# EAGLE design eDP_DLT (EAGLE 9.4.2)
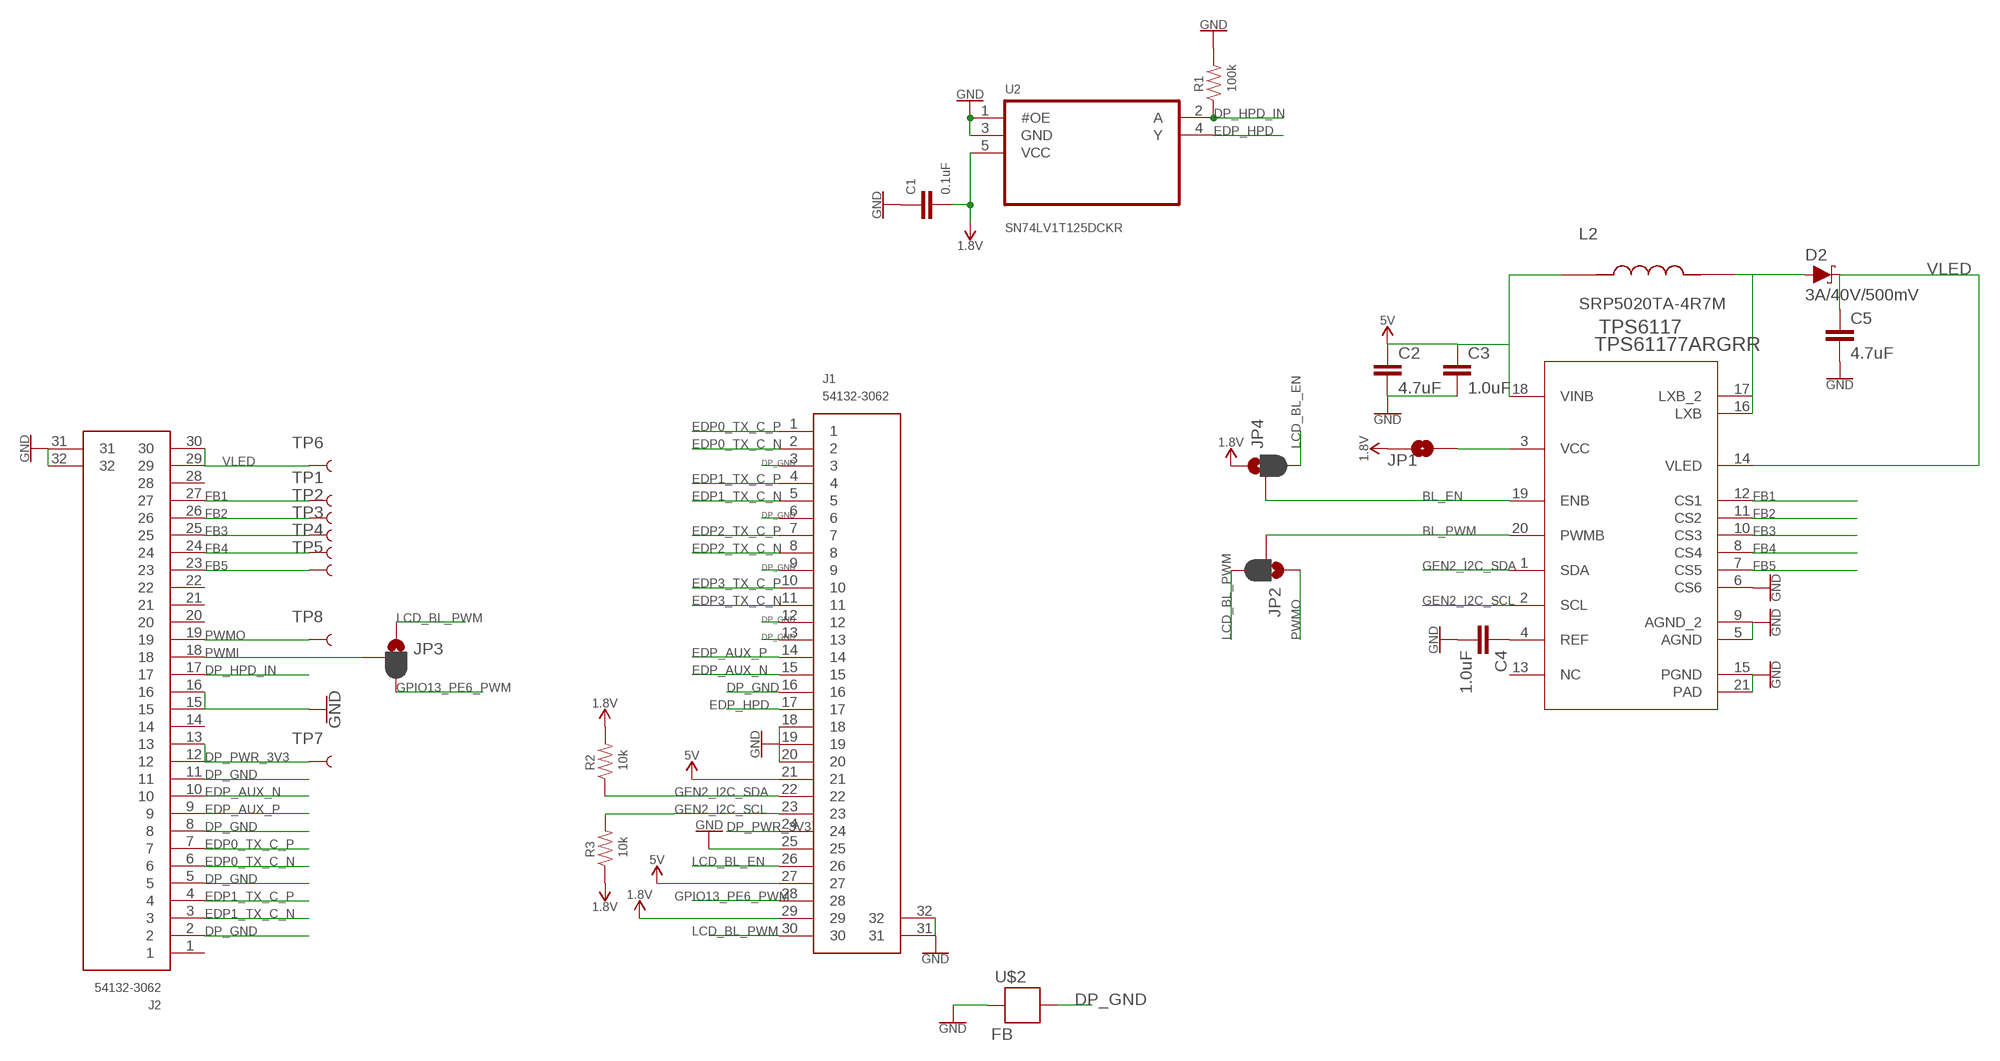
[diagram p0: schematic, sheet 1]

## Parts
C1  0.1uF  10NF-0603-50V-10%  [0603]
C2  4.7uF  4.7UF0603  [0603]
C3  1.0uF  1.0UF-0603-16V-10%  [0603]
C4  1.0uF  1.0UF-0603-16V-10%  [0603]
C5  4.7uF  4.7UF0603  [0603]
D2  3A/40V/500mV  DIODE-SCHOTTKY-B340A  [SMA-DIODE]
J1  54132-3062  [54132-3062]
J2  54132-3062  [54132-3062]
JP1  JUMPER-SMT_2_NO_NO-SILK  [SMT-JUMPER_2_NO_NO-SILK]
JP2  JUMPER-SMT_3_1-NC_PASTE_NO-SILK  [SMT-JUMPER_3_1-NC_PASTE_NO-SILK]
JP3  JUMPER-SMT_3_1-NC_PASTE_NO-SILK  [SMT-JUMPER_3_1-NC_PASTE_NO-SILK]
JP4  JUMPER-SMT_3_1-NC_PASTE_NO-SILK  [SMT-JUMPER_3_1-NC_PASTE_NO-SILK]
L2  SRP5020TA-4R7M  [IND_SRP5020TA-4R7M]
R1  100k  RESISTOR0603-RES  [0603-RES]
R2  10k  RESISTOR0603-RES  [0603-RES]
R3  10k  RESISTOR0603-RES  [0603-RES]
TP1  TEST-POINT3  [PAD.03X.03]
TP2  TEST-POINT3  [PAD.03X.03]
TP3  TEST-POINT3  [PAD.03X.03]
TP4  TEST-POINT3  [PAD.03X.03]
TP5  TEST-POINT3  [PAD.03X.03]
TP6  TEST-POINT3  [PAD.03X.03]
TP7  TEST-POINT3  [PAD.03X.03]
TP8  TEST-POINT3  [PAD.03X.03]
TPS6117  TPS61177ARGRR  [RGR0020A]
U2  SN74LV1T125DCKR  [SOT65P210X110-5N]
U$2  FB  [0603]

## Nets
1.8V: C1.2 J1.29 JP1.1 JP4.1 R2.2 R3.1 U2.5(VCC)
5V: C2.1 C3.1 J1.21 J1.27 L2.1 TPS6117.18(VINB)
BL_EN: JP4.2 TPS6117.19(ENB)
BL_PWM: JP2.2 TPS6117.20(PWMB)
DP_GND: J1.3 J1.6 J1.9 J1.12 J1.13 J1.16 J2.2 J2.5 J2.8 J2.11 U$2.1
DP_HPD_IN: J2.17 R1.1 U2.2(A)
DP_PWR_3V3: J1.24 J2.12 J2.13 TP7.P$1
EDP0_TX_C_N: J1.2 J2.6
EDP0_TX_C_P: J1.1 J2.7
EDP1_TX_C_N: J1.5 J2.3
EDP1_TX_C_P: J1.4 J2.4
EDP2_TX_C_N: J1.8
EDP2_TX_C_P: J1.7
EDP3_TX_C_N: J1.11
EDP3_TX_C_P: J1.10
EDP_AUX_N: J1.15 J2.10
EDP_AUX_P: J1.14 J2.9
EDP_HPD: J1.17 U2.4(Y)
FB1: J2.27 TP1.P$1 TPS6117.12(CS1)
FB2: J2.26 TP2.P$1 TPS6117.11(CS2)
FB3: J2.25 TP3.P$1 TPS6117.10(CS3)
FB4: J2.24 TP4.P$1 TPS6117.8(CS4)
FB5: J2.23 TP5.P$1 TPS6117.7(CS5)
GEN2_I2C_SCL: J1.23 R3.2 TPS6117.2(SCL)
GEN2_I2C_SDA: J1.22 R2.1 TPS6117.1(SDA)
GND: C1.1 C2.2 C3.2 C4.2 C5.2 J1.18 J1.19 J1.20 J1.25 J1.31 J1.32 J2.15 J2.16 J2.31 J2.32 R1.2 TPS6117.5(AGND) TPS6117.6(CS6) TPS6117.9(AGND_2) TPS6117.15(PGND) TPS6117.21(PAD) U2.1(#OE) U2.3(GND) U$2.2
GPIO13_PE6_PWM: J1.28 JP3.3
LCD_BL_EN: J1.26 JP4.3
LCD_BL_PWM: J1.30 JP2.3 JP3.1
LXB: D2.A L2.2 TPS6117.16(LXB) TPS6117.17(LXB_2)
N$1: JP1.2 TPS6117.3(VCC)
N$3: C4.1 TPS6117.4(REF)
PWMI: J2.18 JP3.2
PWMO: J2.19 JP2.1 TP8.P$1
VLED: C5.1 D2.C J2.29 J2.30 TP6.P$1 TPS6117.14(VLED)
Unconnected: J2.1 J2.14 J2.20 J2.21 J2.22 J2.28 TPS6117.13(NC)

## Library data of the parts
C1 = SparkFun-Capacitors:10NF: 0.01uF/10nF/10,000pF ceramic capacitors A capacitor is a passive two-terminal electrical component used to store electrical energy temporarily in an electric field. CAP-09321; PROD_ID: CAP-00867; VALUE: 10nF
C2 C5 = SparkFun-Capacitors:4.7UF: 4.7µF ceramic capacitors A capacitor is a passive two-terminal electrical component used to store electrical energy temporarily in an electric field.; PROD_ID: CAP-08280
C3 C4 = SparkFun-Capacitors:1.0UF: 1µF ceramic capacitors A capacitor is a passive two-terminal electrical component used to store electrical energy temporarily in an electric field.; PROD_ID: CAP-00868
D2 = SparkFun-DiscreteSemi:DIODE-SCHOTTKY: Schottky diode A Schottky diode is a semiconductor diode which has a low forward voltage drop and a very fast switching action.; PROD_ID: DIO-09886
J1 J2 = 54132-3062:54132-3062: Connector 0.5mm, FFC/FPC, SMT,r/a,30w,Au Molex FFC/FPC SMT Series 0.5mm Pitch 30 Way Right Angle SMT Female FPC Connector, ZIF Bottom Contact Source: Datasheet <https://componentsearchengine.com/Datasheets/1/54132-3062.pdf>; DESCRIPTION: Connector 0.5mm, FFC/FPC, SMT,r/a,30w,Au Molex FFC/FPC SMT Series 0.5mm Pitch 30 Way Right Angle SMT Female FPC Connector, ZIF Bottom Contact; HEIGHT: mm; MANUFACTURER_NAME: Molex; MANUFACTURER_PART_NUMBER: 54132-3062; MOUSER_PART_NUMBER: 538-54132-3062; MOUSER_PRICE-STOCK: https://www.mouser.com/Search/Refine.aspx?Keyword=538-54132-3062
JP1 = SparkFun-Jumpers:JUMPER-SMT_2_NO: Normally open jumper This jumper has two pads in close proximity to each other. Apply solder to close the connection. Round pads are easier to solder for beginners, but are a lot larger. SparkFun Product that uses the round pads: SparkFun EL Sequencer <https://www.sparkfun.com/products/12781>
JP2-JP4 = SparkFun-Jumpers:JUMPER-SMT_3_1-NC_PASTE: Normally closed solder jumper (1 of 2 connections) This jumper has an aperture in the stencil to allow solder paste to bridge one of the two connections. One connection is normally closed (NC), while the other is normally open (NO). Wick off the solder to open the connection. Reapply solder to reclose the connection. Apply solder to the other side instead to change the current path.
L2 = Custom-Parts:SRP5020TA-4R7M: Ind Chip Power Shielded Wirewound 4.7uH 20% 100KHz 18Q-Factor Metal 2.8A T/R; AVAILABILITY: Unavailable; DESCRIPTION: Ind Chip Power Shielded Wirewound 4.7uH 20% 100KHz 18Q-Factor Metal 2.8A T/R; MF: Bourns; MP: SRP5020TA-4R7M; PACKAGE: Nonstandard Bourns; PRICE: None
R1-R3 = SparkFun-Passives:RESISTOR: Resistor Basic schematic elements and footprints for 0603, 1206, and PTH resistors.
TP1-TP8 = SparkFun-Connectors:TEST-POINT: SparkFun Test Points Bare copper test points for troubleshooting or In-Circuit-Testing. These are used by our Production team for verifying production board runs using pogo-pins on test beds. SparkFun Products: SparkFun LSM9DS1 Breakout <https://www.sparkfun.com/products/13284> SparkFun PSOC <https://www.sparkfun.com/products/13714> SparkFun Load Cell Amplifier <https://www.sparkfun.com/products/13879>
TPS6117 = Custom-Parts:TPS61177ARGRR
U2 = SN74LV1T125DCKR:SN74LV1T125DCKR: None; AVAILABILITY: Unavailable; DESCRIPTION: Single Power Supply, Single BUFFER GATE w/ 3-State Output _active low enable_ 5-SC70 -40 to 125; MF: Texas Instruments; MP: SN74LV1T125DCKR; PACKAGE: SC-70-5 Texas Instruments; PRICE: None
U$2 = SparkFun-Passives:FB

## Board
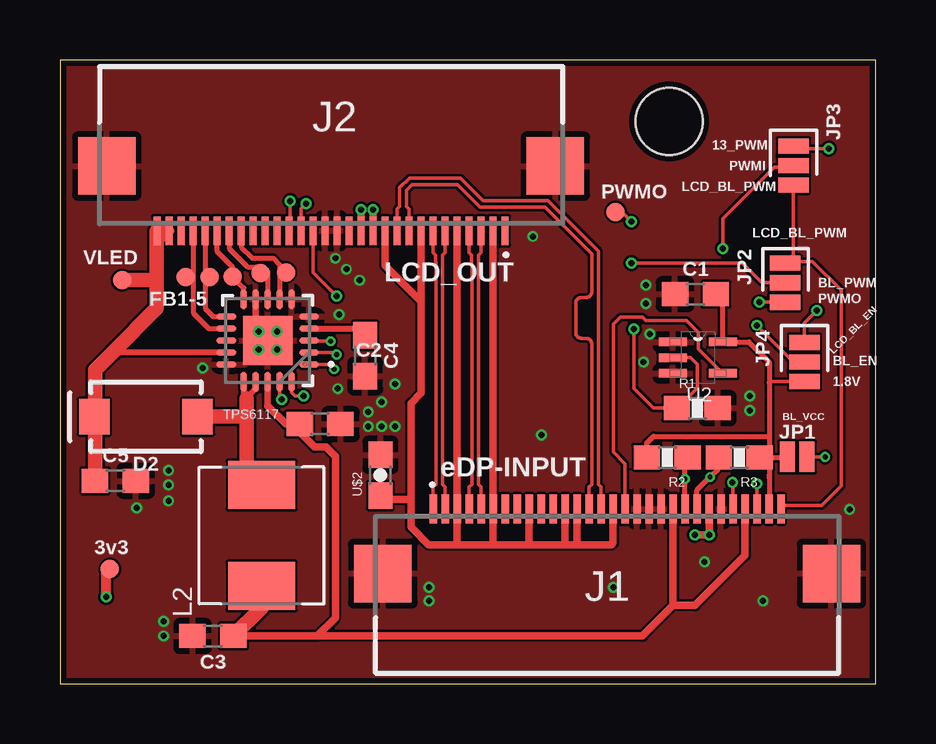
[diagram p1: board, top side]
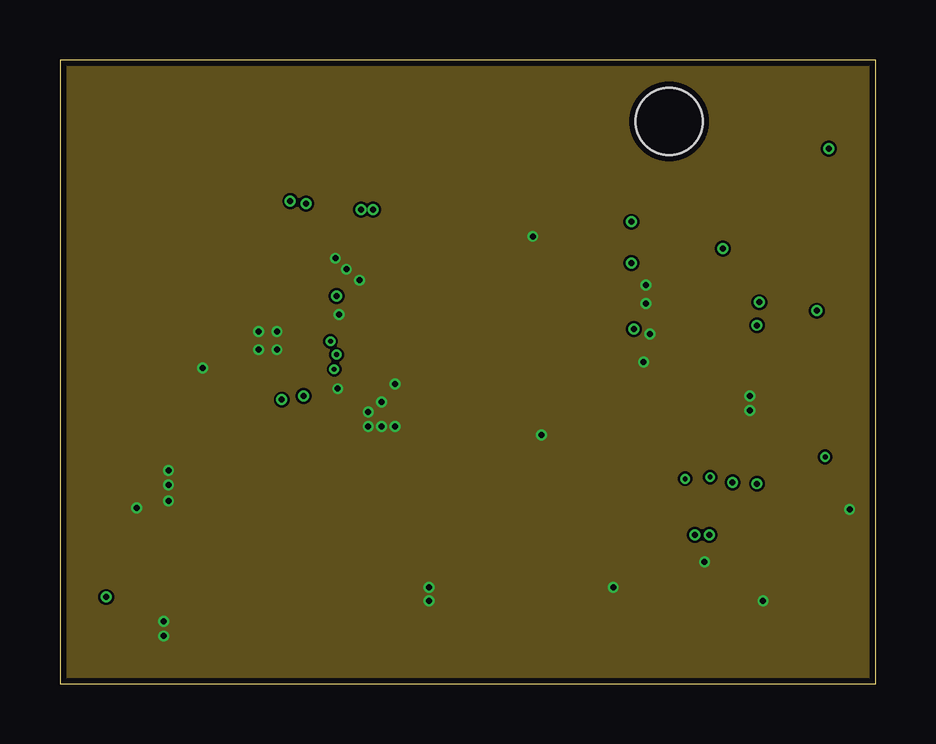
[diagram p2: board, inner layer Route2]
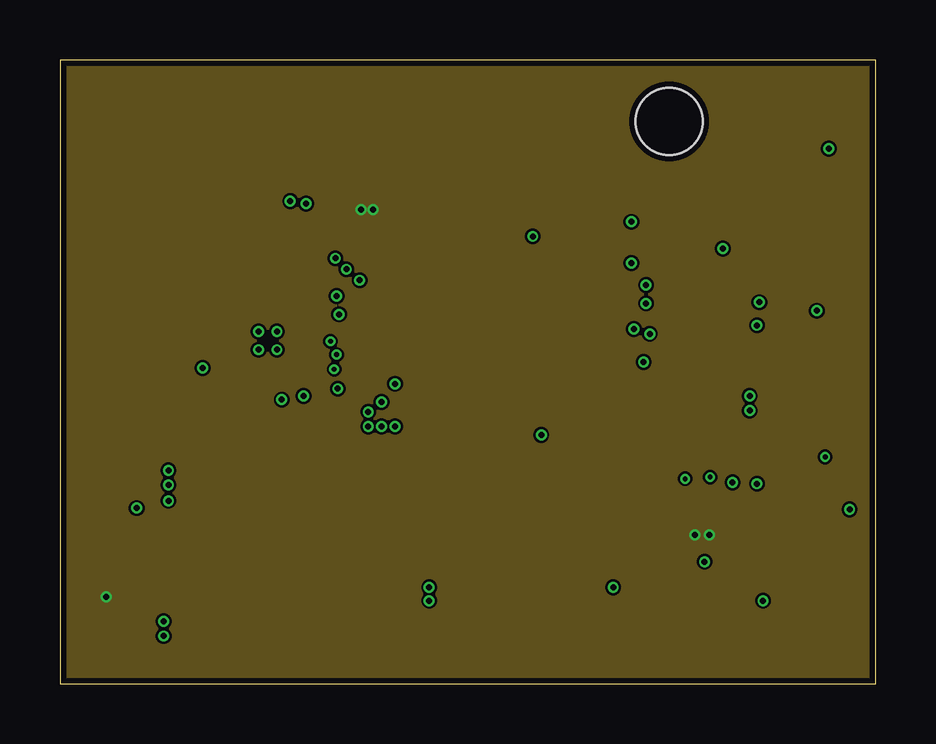
[diagram p3: board, inner layer Route15]
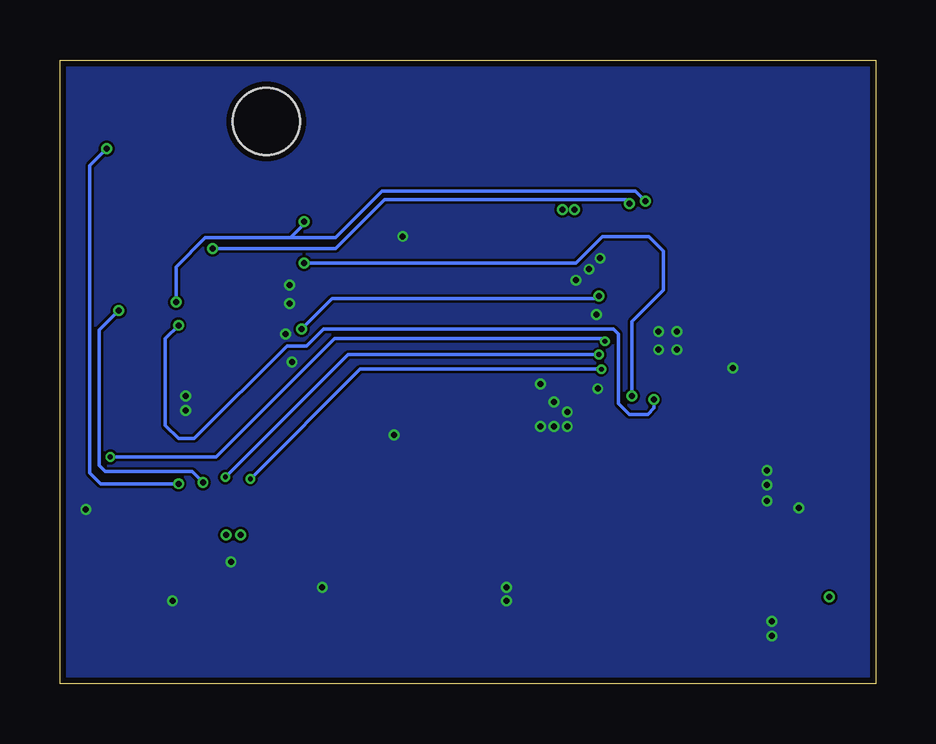
[diagram p4: board, bottom side, seen from below]

Size 34 x 26 mm. Coordinates in mm from the lower left corner, seen from the top.
Outline: 0,0 34,0 34,26 0,26 0,0
Copper layers (1*2*15*16): Top 0.035mm / dielectric 0.2mm / Route2 0.0175mm / dielectric 0.3mm / Route15 0.0175mm / dielectric 0.2mm / Bottom 0.035mm
Design rules "SeeedStudio_4layer_DRU_no_angle_20140221 *": minimum track width 4mil, minimum drill 0.2mm, track to track 4mil, track to pad 4mil, pad to pad 4mil, via to via 4mil, smd to smd 0mil, copper to edge 10mil, drill to drill 8mil, minimum pad ring 6mil, minimum via ring 4mil, stop-mask expansion 4mil, vias tented up to drill 25mil, thermal gap 10mil
Holes 2.8 mm at 25.39,23.44

### Footprints (pad centres in the part's own frame; a part is rotated, then mirrored left to right if it is on the bottom)
0603 = smd 1.1 x 1: 1 -0.85,0; 2 0.85,0
SMA-DIODE = smd 1.27 x 1.47: A -2.15,0; C 2.15,0
54132-3062 = smd 0.3 x 1.2: 1 -7.25,0.3; 2 -6.75,0.3; 3 -6.25,0.3; 4 -5.75,0.3; 5 -5.25,0.3; 6 -4.75,0.3; 7 -4.25,0.3; 8 -3.75,0.3; 9 -3.25,0.3; 10 -2.75,0.3; 11 -2.25,0.3; 12 -1.75,0.3; 13 -1.25,0.3; 14 -0.75,0.3; 15 -0.25,0.3; 16 0.25,0.3; 17 0.75,0.3; 18 1.25,0.3; 19 1.75,0.3; 20 2.25,0.3; 21 2.75,0.3; 22 3.25,0.3; 23 3.75,0.3; 24 4.25,0.3; 25 4.75,0.3; 26 5.25,0.3; 27 5.75,0.3; 28 6.25,0.3; 29 6.75,0.3; 30 7.25,0.3 | smd 2.4 x 2.4: 31 -9.35,-2.4; 32 9.35,-2.4
SMT-JUMPER_2_NO_NO-SILK = smd 0.635 x 1.27: 1 -0.406,0; 2 0.406,0
SMT-JUMPER_3_1-NC_PASTE_NO-SILK = smd 0.635 x 1.27: 1 -0.813,0; 2 0,0; 3 0.813,0
IND_SRP5020TA-4R7M = smd 2 x 2.8: 1 -2.1,0; 2 2.1,0
0603-RES = smd 1.1 x 1: 1 -0.85,0; 2 0.85,0
PAD.03X.03 = smd 0.762 x 0.762: P$1 0,0
RGR0020A = smd 0.838 x 0.279: 1 -1.725,1; 2 -1.725,0.5; 3 -1.725,0; 4 -1.725,-0.5; 5 -1.725,-1; 11 1.725,-1; 12 1.725,-0.5; 13 1.725,0; 14 1.725,0.5; 15 1.725,1 | smd 0.279 x 0.838: 6 -1,-1.725; 7 -0.5,-1.725; 8 0,-1.725; 9 0.5,-1.725; 10 1,-1.725; 16 1,1.725; 17 0.5,1.725; 18 0,1.725; 19 -0.5,1.725; 20 -1,1.725 | smd 2.057 x 2.057: 21 0,0
SOT65P210X110-5N = smd 1.168 x 0.356: 1 -1.041,0.66; 2 -1.041,0; 3 -1.041,-0.66; 4 1.041,-0.66; 5 1.041,0.66

### Placement (x,y rotation side)
C1  26.49,16.23 0 top
C2  10.85,10.82 0 top
C3  6.38,1.98 180 top
C4  12.73,13.67 270 top
C5  2.31,8.46 0 top
D2  3.58,11.13 180 top
J1  22.81,6.99 0 top
J2  11.3,19.18 180 top
JP1  30.73,9.45 0 top
JP2  30.23,16.71 90 top
JP3  30.58,21.59 90 top
JP4  31.04,13.41 90 top
L2  8.41,6.17 90 top
R1  26.57,11.48 0 top
R2  25.32,9.43 180 top
R3  28.32,9.43 180 top
TP1  5.23,16.94 0 top
TP2  6.25,16.94 0 top
TP3  7.19,16.97 0 top
TP4  8.36,17.12 0 top
TP5  9.42,17.14 0 top
TP6  2.59,16.81 0 top
TP7  2.08,4.78 0 top
TP8  23.16,19.66 0 top
TPS6117  8.66,14.3 180 top
U2  26.59,13.59 0 top
U$2  13.36,8.69 90 top

### Tracks (layer width: path | path; a pad name or v marks a point on that pad's centre or on a via)
1.8V
  Top 0.152: 29.57,12.55 29.62,12.6 JP4.1
  Top 0.203: C1.2 27.64,15.94 U2.5 28.73,14.25 29.57,13.41 29.57,12.55 29.57,10.31 | 29.57,10.31 29.57,9.4 | 29.57,9.4 29.57,8.69 29.57,8.59 J1.29 | 29.57,9.4 29.53,9.43 R3.1 30.31,9.43 JP1.1 | R2.2 24.47,10.04 24.74,10.31 29.57,10.31
5V
  Top 0.279: 8.66,11.58 TPS6117.18
  Top 0.305: 7.26,1.94 C3.1 | 10.08,11.12 10.36,10.85 10.02,10.85 C2.1 9.75,10.82 | 9.75,10.82 9.42,10.82 8.66,11.58 | C3.1 10.72,1.98 11.48,2.74 11.48,9.47 11.1,9.86 10.62,9.86 9.75,10.72 9.75,10.82 | J1.21 25.56,3.26 | C3.1 24.28,1.98 25.56,3.26 | J1.27 28.56,5.34 26.47,3.26 25.56,3.26
  Top 0.61: C3.1 8.41,3.16 L2.1
BL_EN  (via drill 0.25)
  Top 0.152: JP4.2 30.58,13.41 v29.06,14.94 | v9.25,11.84 9.16,11.92 TPS6117.19
  Bottom 0.152: v29.06,14.94 29.62,14.38 29.62,10.77 29.06,10.21 28.4,10.21 24.54,14.07 23.72,14.07 23.01,14.78 10.92,14.78 10.72,14.58 10.72,11.68 10.26,11.23 9.5,11.23 9.25,11.48 v9.25,11.84
BL_PWM  (via drill 0.25)
  Top 0.152: JP2.2 29.26,16.71 28.45,17.53 v23.82,17.53 | v10.16,11.99 9.8,11.99 9.66,12.13 TPS6117.20
  Bottom 0.152: v23.82,17.53 12.5,17.53 11.38,18.64 9.45,18.64 8.84,18.03 8.84,16.41 10.16,15.09 v10.16,11.99
DP_GND
  Top 0.305: J2.5 J1.3 16.56,5.84 16.61,5.79 | J2.2 J1.6 18.06,5.82 18.03,5.79 | J1.16 23.06,5.86 22.99,5.79 21.51,5.79 | 21.51,5.79 20.98,5.79 | 20.98,5.79 19.56,5.79 | 19.56,5.79 18.03,5.79 | 18.03,5.79 16.61,5.79 | 16.61,5.79 15.37,5.79 14.63,6.53 14.63,7.67 | J1.9 19.56,5.79 | J1.12 21.06,5.87 20.98,5.79 | J1.13 21.56,5.84 21.51,5.79 | J2.8 15.05,15.93 | 15.05,15.93 15.05,12.11 14.63,11.68 14.63,7.67 | J2.11 13.55,17.43 15.05,15.93 | 14.63,7.67 13.53,7.67 U$2.1
DP_HPD_IN  (via drill 0.25)
  Top 0.152: U2.2 26.29,13.59 26.57,13.31 26.57,12.33 R1.1 24.74,11.48 23.93,12.29 v23.93,14.78 | v11.53,16.15 10.55,17.13 J2.17
  Bottom 0.152: v23.93,14.78 22.66,16.05 11.58,16.05 11.53,16.1 v11.53,16.15
DP_PWR_3V3  (via drill 0.25)
  Top 0.305: J1.24 27.08,7.29 v27.08,6.2 v26.47,6.2 | v12.55,19.76 J2.13 | v13.06,19.76 J2.12
  Top 0.406: v1.93,3.61 1.93,4.62 TP7.P$1
  pour Route15: -3,29 37,29 37,-3 -3,-3
EDP0_TX_C_N
  Top 0.152: J1.2 16.06,8.19 15.95,8.3 15.94,17.86 16.05,17.97 J2.6
EDP0_TX_C_P
  Top 0.152: J1.1 15.56,8.19 15.67,8.3 15.67,17.3 15.66,17.86 15.55,17.97 J2.7
EDP1_TX_C_N
  Top 0.152: J2.3 17.55,17.97 17.45,17.86 17.45,17.65 17.45,17.02 17.45,8.3 17.56,8.19 J1.5
EDP1_TX_C_P
  Top 0.152: J2.4 17.05,17.97 17.16,17.86 17.17,17.02 | J1.4 17.06,8.19 17.17,8.3 17.17,17.02 | 17.17,17.02
EDP_AUX_N
  Top 0.152: J1.15 22.56,8.19 22.45,8.3 22.45,14.16 22.45,16.33 22.45,18.03 20.33,20.14 17.63,20.14 16.69,21.08 14.56,21.08 14.16,20.68 14.16,19.89 14.05,19.78 J2.10
EDP_AUX_P
  Top 0.152: J1.14 22.06,8.19 22.17,8.3 22.17,14.16 arc90 21.93,14.39 21.74,14.39 arc-90 21.5,14.63 21.5,15.86 arc-90 21.74,16.1 21.93,16.1 arc90 22.17,16.33 22.17,17.91 20.22,19.86 17.51,19.86 16.57,20.8 14.68,20.8 14.44,20.56 14.44,19.89 14.55,19.78 J2.9
EDP_HPD
  Top 0.152: U2.4 26.62,13.95 26.62,14.63 26.11,15.14 24.43,15.14 24.28,15.29 23.37,15.29 23.06,14.99 23.06,9.65 23.56,9.16 J1.17
FB1
  Top 0.203: J2.27 5.55,17.22 5.55,16.94 | 5.55,16.94 5.55,15.45 6.21,14.8 TPS6117.12 | TP1.P$1 5.55,16.94
FB2
  Top 0.203: J2.26 6.05,16.94 | 6.05,16.94 6.05,15.64 6.39,15.3 TPS6117.11 | TP2.P$1 6.05,16.94
FB3
  Top 0.203: TPS6117.10 7.66,16.49 TP3.P$1 7.19,17.37 6.55,18.01 J2.25
FB4
  Top 0.203: J2.24 7.05,18.14 7.82,17.37 8.18,17.37 | 8.18,17.37 8.46,17.37 8.66,17.17 TPS6117.8 | TP4.P$1 8.18,17.3 8.18,17.37
FB5
  Top 0.203: J2.23 7.55,18.2 8.03,17.73 8.89,17.73 9.16,17.46 9.16,17.17 | 9.16,17.17 TPS6117.7 | TP5.P$1 9.4,17.17 9.16,17.17
GEN2_I2C_SCL  (via drill 0.2)
  Top 0.152: TPS6117.2 11.45,13.8 v11.53,13.72
  Top 0.203: R3.2 27.47,8.98 v27.1,8.61 26.56,8.07 J1.23
  Bottom 0.152: v11.53,13.72 22,13.72 v27.1,8.61
GEN2_I2C_SDA  (via drill 0.2)
  Top 0.152: TPS6117.1 11.24,13.3 v11.43,13.11
  Top 0.203: J1.22 v26.06,8.53 26.06,9.32 R2.1
  Bottom 0.152: v11.43,13.11 21.49,13.11 v26.06,8.53
GND  (via drill 0.25)
  Top 0.203: TPS6117.21 v9.04,13.92
  Top 0.279: TPS6117.9 8.16,14.68 v8.28,14.68
  other vias: 9.04,14.68 8.28,13.92 5.94,13.16 11.63,15.39 4.52,8.89 4.52,8.28 4.52,7.62 3.2,7.32 4.32,1.98 4.32,2.59 15.39,3.45 15.39,4.01 13.97,10.72 13.41,10.72 12.85,10.72 12.85,11.33 13.41,11.73 11.58,12.29 13.97,12.5 19.71,18.64 20.07,10.36 28.75,11.99 28.75,11.38 24.33,13.41 24.59,14.58 24.43,15.85 24.43,16.61 11.48,17.73 11.94,17.27 12.5,16.81 26.87,5.08 23.06,4.01 29.31,3.45 32.92,7.26
  pour Top: -1,27 35,27 35,-1 -1,-1
  pour Route2: -2,28 36,28 36,-2 -2,-2
  pour Bottom: -4,30 38,30 38,-4 -4,-4
GPIO13_PE6_PWM  (via drill 0.25)
  Top 0.152: J1.28 v29.06,8.33 | v32.05,22.3 30.68,22.3 JP3.3
  Bottom 0.152: v29.06,8.33 32.31,8.33 32.77,8.79 32.77,21.59 v32.05,22.3
LCD_BL_EN  (via drill 0.25)
  Top 0.152: J1.26 28.06,8.36 v28.04,8.38 | v31.55,15.54 31.04,15.04 JP4.3
  Bottom 0.152: v28.04,8.38 28.5,8.84 32.11,8.84 32.36,9.09 32.36,14.73 v31.55,15.54
LCD_BL_PWM
  Top 0.152: JP3.1 30.58,17.88 30.3,17.6 | 30.3,17.6 JP2.3 | J1.30 30.19,7.42 31.75,7.42 32.56,8.23 32.56,16.41 31.37,17.6 30.3,17.6
LXB
  Top 0.254: TPS6117.16 7.66,12 7.77,11.89 8.16,12.28 TPS6117.17
  Top 0.61: 7.77,11.89 7.77,11 | 7.77,11 7.77,8.2 8.34,8.2 L2.2 | D2.A 7.64,11.12 7.77,11
N$1  (via drill 0.2)
  Top 0.152: JP1.2 v31.9,9.45 | v11.28,14.28 10.41,14.28 TPS6117.3
  Bottom 0.152: v11.28,14.28 11.38,14.38 22.55,14.38 27.48,9.45 v31.9,9.45
N$3
  Top 0.254: TPS6117.4 12.44,14.8 C4.1
PWMI  (via drill 0.25)
  Top 0.152: JP3.2 30.52,21.53 29.77,21.53 27.64,19.39 v27.64,18.14 | v10.26,20.02 10.05,19.81 J2.18
  Bottom 0.152: v27.64,18.14 22.5,18.14 20.47,20.17 10.41,20.17 v10.26,20.02
PWMO  (via drill 0.25)
  Top 0.152: JP2.1 v29.16,15.9 | v9.6,20.12 9.6,18.93 J2.19 | v23.82,19.25 23.42,19.66 TP8.P$1
  Bottom 0.152: v29.16,15.9 29.16,17.37 27.94,18.59 24.38,18.59 | v9.6,20.12 10.01,20.52 20.57,20.52 22.5,18.59 24.38,18.59 | 24.38,18.59 23.82,19.15 v23.82,19.25
VLED
  Top 0.254: TPS6117.14 2.19,13.8 1.42,13.03 D2.C 1.46,11.1
  Top 0.406: J2.30 J2.29 4.04,18.36 4.04,17.78
  Top 0.508: D2.C
  Top 0.61: C5.1 1.46,9.93 | 1.46,9.93 1.46,11.1 D2.C | 1.46,9.93 1.46,13.07 2.19,13.8 4.04,15.65 4.04,16.71 | J2.30 4.04,18.86 4.04,17.78 4.04,16.71 | TP6.P$1 3.94,16.82 4.04,16.71

### Text on the board
tPlace: 13_PWM | LCD_BL_PWM | PWMI | PWMO | LCD_BL_PWM | VLED | LCD_OUT | BL_PWM | FB1-5 | PWMO | LCD_BL_EN | BL_EN | 1.8V | BL_VCC | eDP-INPUT | 3v3